# EAGLE design Grove - RTC v1.1 (EAGLE 6.1)
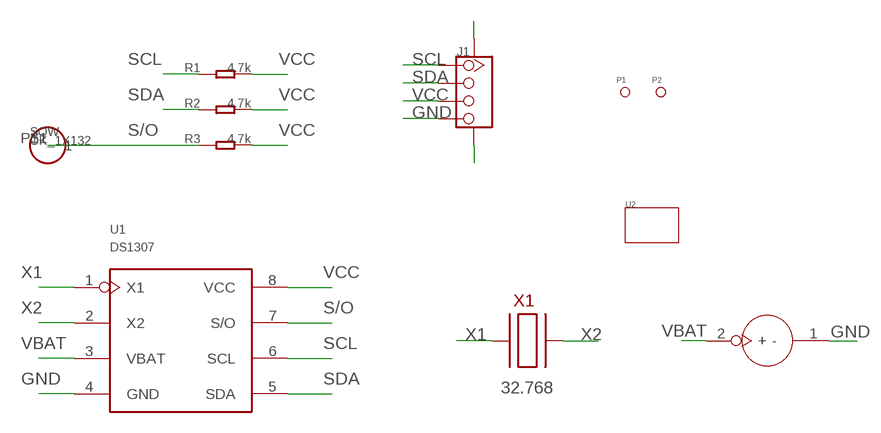
[diagram p0: schematic, sheet 1]

## Parts
J1  TWIG-4P-2.0-SMD-FEMALE-REINFORCE'DD'  [4P-SMD-2.0]
P1  PAD-MARK  [ROUND-MARK-1.0]
P2  PAD-MARK  [ROUND-MARK-1.0]
R1  4.7k  R0603  [0603]
R2  4.7k  R0603  [0603]
R3  4.7k  R0603  [0603]
SQW  CK_1X132  [CK_1X1]
U1  DS1307  [SO08]
U2  TWIG-2U  [2U-DIM-W/-DRILL]
U3  BATTERYBATTERY1225_SMT  [BATTERY1225_SMT]
X1  XTL_S  [XTL_S]

## Nets
GND: J1.4 J1.SS1 J1.SS2 U1.4(GND) U3.1(-)
S/O: R3.1 SQW.P$1 U1.7(S/O)
SCL: J1.1 R1.1 U1.6(SCL)
SDA: J1.2 R2.1 U1.5(SDA)
VBAT: U1.3(VBAT) U3.2(+)
VCC: J1.3 R1.2 R2.2 R3.2 U1.8(VCC)
X1: U1.1(X1) X1.1
X2: U1.2(X2) X1.2

## Notes on the sheet
- 32.768

## Library data of the parts
J1 = Connector:TWIG-4P-2.0-SMD-FEMALE-REINFORCE
P1 P2 = Discrete:PAD-MARK; PARTNO: DNP
R1-R3 = CPT_SMD:R0603
SQW = CONNECTER:CK_1X1
U1 = Seeed:DS1307
U2 = moudle:TWIG
U3 = seeedleo:BATTERY
X1 = template:XTL_S

## Board
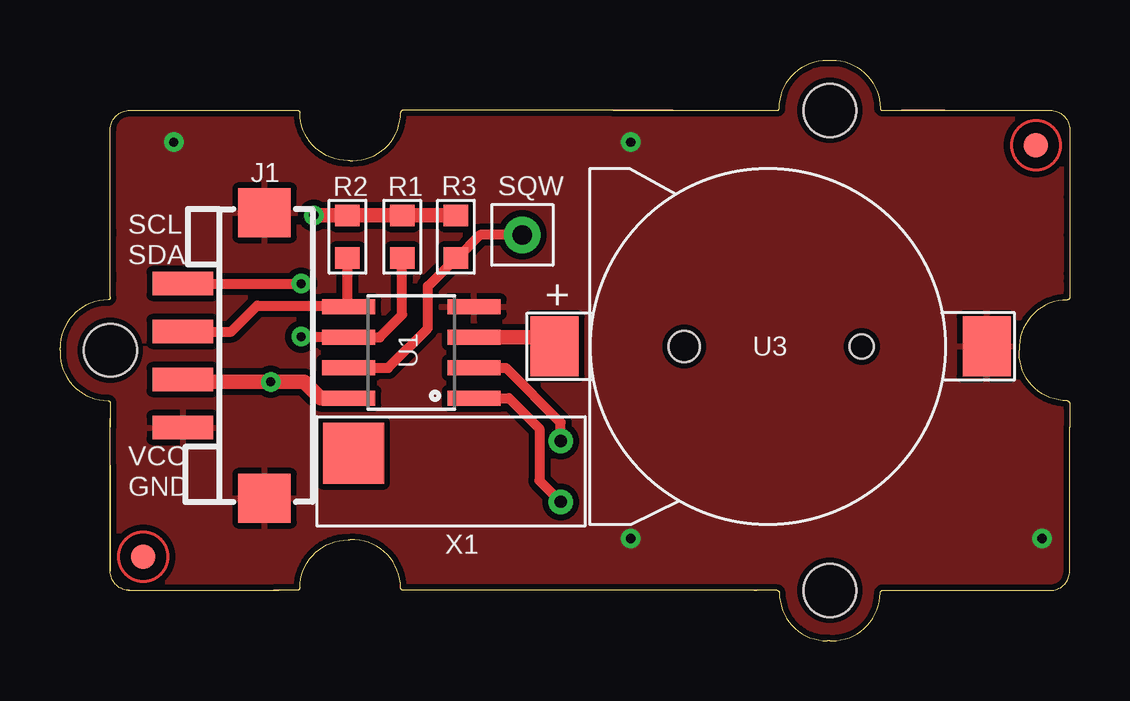
[diagram p1: board, top side]
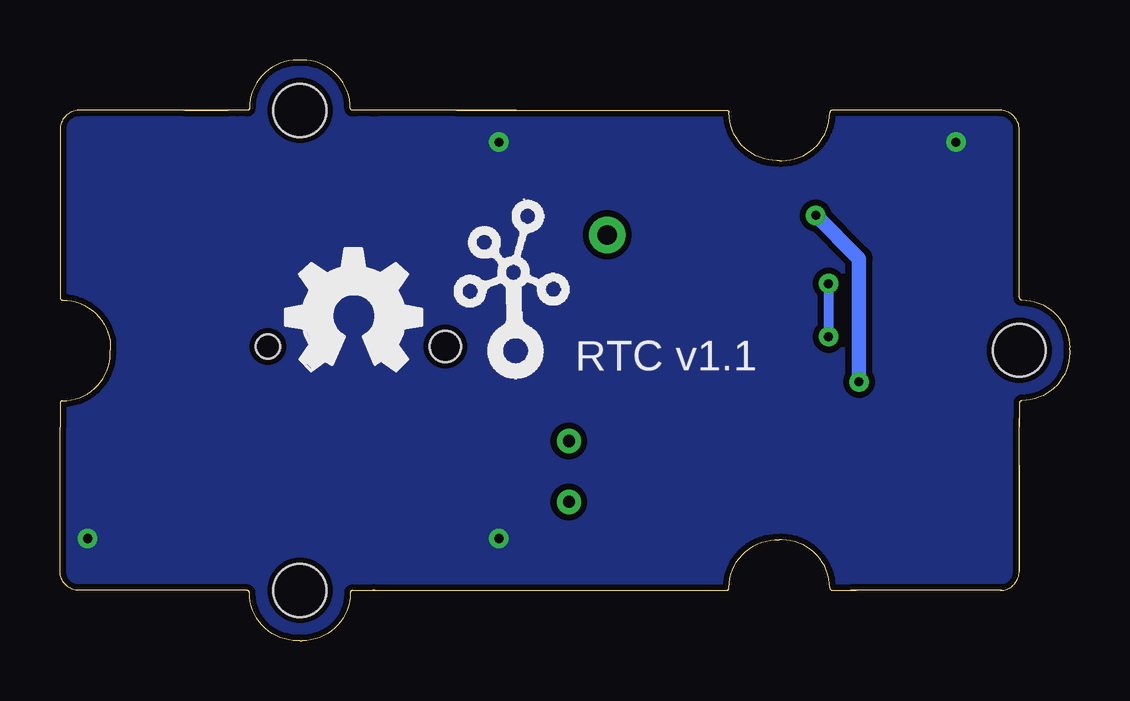
[diagram p2: board, bottom side, seen from below]

Size 42.09 x 24.2 mm. Coordinates in mm from the lower left corner, seen from the top.
Copper layers (1*16): Top 0.035mm / dielectric 1.5mm / Bottom 0.035mm
Design rules: minimum track width 6mil, minimum drill 12mil, track to track 6mil, track to pad 6mil, pad to pad 6mil, via to via 6mil, smd to smd 0mil, copper to edge 10mil, drill to drill 10mil, minimum pad ring 10mil, minimum via ring 6mil, stop-mask expansion 2mil, vias tented up to drill 100mil, thermal gap 10mil

### Footprints (pad centres in the part's own frame; a part is rotated, then mirrored left to right if it is on the bottom)
4P-SMD-2.0 = smd 0.965 x 2.54: 1 -3,0; 2 -1,0; 3 1,0; 4 3,0 | smd 2.032 x 2.184: SS1 -5.946,3.4; SS2 5.946,3.4
ROUND-MARK-1.0 = smd 1.016 x 1.016: P$1 0,0
0603 = smd 0.889 x 1.016: 1 -0.889,0; 2 0.889,0
CK_1X1 = drill 0.813 pad 1.524: P$1 0,0
SO08 = smd 0.61 x 2.21: 1 -1.905,-2.616; 2 -0.635,-2.616; 3 0.635,-2.616; 4 1.905,-2.616; 5 1.905,2.616; 6 0.635,2.616; 7 -0.635,2.616; 8 -1.905,2.616
2U-DIM-W/-DRILL = hole 2.2: 10.453,-10.42; 10.453,9.58; -19.535,-0.415
BATTERY1225_SMT = smd 2 x 2.5: 1 -9.119,0; 2 8.89,0 | hole 1: -3.913,0 | hole 1.3: 3.487,0
XTL_S = drill 0.508: 1 0,0; 2 0,-2.54 | smd 2.54 x 2.54: 3 8.636,-2.032

### Placement (x,y rotation side)
J1  5.13,11.88 270 top
P1  3.47,3.5 0 top
P2  40.69,20.65 0 top
R1  14.27,16.84 90 top
R2  11.98,16.84 90 top
R3  16.5,16.84 90 top
SQW  19.27,16.91 270 top
U1  14.65,12.01 90 top
U2  21.64,12.52 0 top
U3  29.51,12.27 180 top
U$1  [OSHW_FILLX200_NOTEXT]  32.68,11.25 0 bottom
U$3  [TWIGLOGO]  23.16,11.88 0 bottom
X1  20.87,5.79 180 top

### Tracks (layer width: path | path; a pad name or v marks a point on that pad's centre or on a via)
GND  (via drill 0.38 pad 0.81)
  other vias: 23.79,4.26 40.94,4.26 23.79,20.77 4.74,20.77
  pour Top (isolate 0.254): -0.34,22.05 -0.34,23.31 -0.34,24.59 42.84,24.59 42.84,-0.82 -0.34,-0.82
  pour Bottom (isolate 0.254): -0.34,22.05 -0.34,23.31 -0.34,24.59 42.84,24.59 42.84,-0.82 -0.34,-0.82
S/O
  Top 0.406: U1.7 13.69,11.38 15.34,13.03 15.34,14.78 R3.1 16.56,15.95 | SQW.P$1 17.52,16.91 16.56,15.95 | 16.58,15.95 16.56,15.95
SCL  (via drill 0.38 pad 0.81)
  Top 0.406: v10.05,14.88 J1.1 | v10.05,12.67 12.01,12.67 U1.6 13.33,12.65 14.27,13.59 R1.1
  Bottom 0.406: v10.05,14.88 v10.05,12.67 10.08,12.65
SDA
  Top 0.406: 11.98,13.97 R2.1 | 11.98,13.97 U1.5 | 11.98,13.97 8.22,13.97 7.14,12.88 J1.2
VBAT
  Top 0.61: U1.3 20.24,12.65 U3.2
VCC  (via drill 0.38 pad 0.81)
  Top 0.61: R3.2 R1.2 R2.2 v10.59,17.73 | U1.8 10.87,10.11 10.18,10.79 v8.78,10.79 5.2,10.79 5.13,10.87 J1.3
  Bottom 0.61: v8.78,10.79 8.78,15.92 v10.59,17.73
X1
  Top 0.406: U1.1 18.71,10.11 19.98,8.84 19.98,6.68 X1.1
X2
  Top 0.406: U1.2 18.59,11.38 20.87,9.09 X1.2

### Text on the board
tPlace: SCL | SDA | VCC | GND
bPlace: RTC v1.1